# Altium schematic sheet sensors.SchDoc: Sensors
size A4; ApprovedBy: Othniel Konan; CheckedBy: Othniel Konan; Author: Othniel Konan; DrawnBy: Othniel Konan; Engineer: Othniel Konan; Address1: NPSC; Address2: Othniel Konan; Address3: ECE 2017; DocumentNumber: 1; Revision: 1.0; SheetNumber: 1; SheetTotal: 1; ProjectName: NPSC
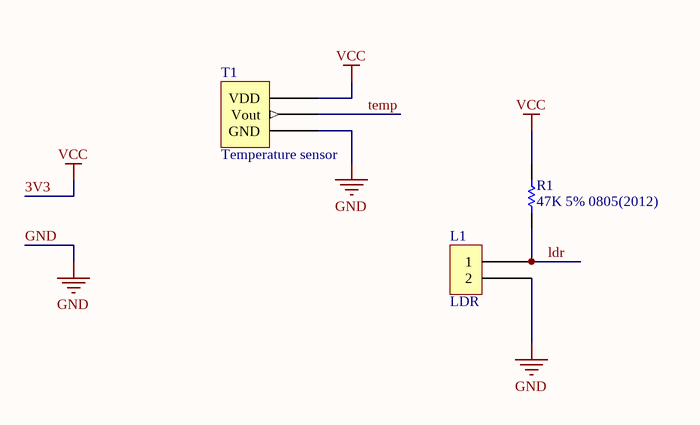
[diagram p0: sensors.SchDoc]

## Parts
L1  LDR  [TO-18]
R1  47K 5% 0805(2012)  [RESC0805(2012)_M]
T1  Temperature sensor  [TO-92]

## Nets
3V3: R1.1 T1.1(VDD)  [also labelled VCC]
GND: L1.2 T1.3(GND)
ldr: L1.1 R1.2
temp: T1.2(Vout)

## Notes on the sheet
- Title
- Size:
- Date:
- A4
- Number:
- Time:
- Revision:
- Sheet
- of
- File:

## Library data of the parts
L1 = NSL -19M51
R1 = CMP-1013-00954-1: 8M45 0.125W 1% 0805 (2012 Metric)  SMD; Case-EIA: 0805; Case-Metric: 2012; Value: 8450000.00 Ohm; Technology: SMT; Power: 0.125 W; Tolerance: 1 %
T1 = MCP9700